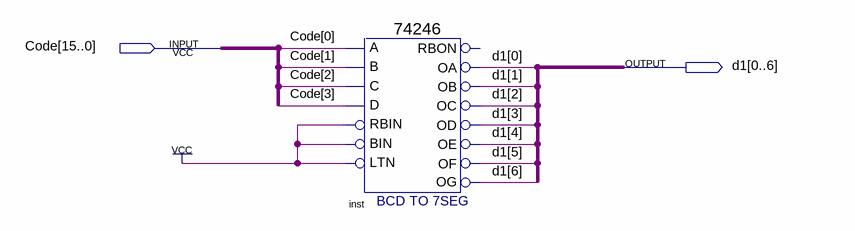
[diagram p0: schematic sheet]
// Quartus schematic Transcodage.bdf as structural Verilog: 1 symbols, 2 pins
module Transcodage (
  input  [15:0] Code,
  output [0:6] d1
);

  \74246  inst (
    .B(Code[1]), .A(Code[0]), .RBIN(1'b1), .D(Code[3]), .C(Code[2]), .LTN(1'b1), .BIN(1'b1), .OD(d1[3]),
    .OC(d1[2]), .OB(d1[1]), .OE(d1[4]), .OF(d1[5]), .OA(d1[0]), .OG(d1[6]));  // open: RBON
endmodule
